# Altium project LEDeep_project.PrjPcb
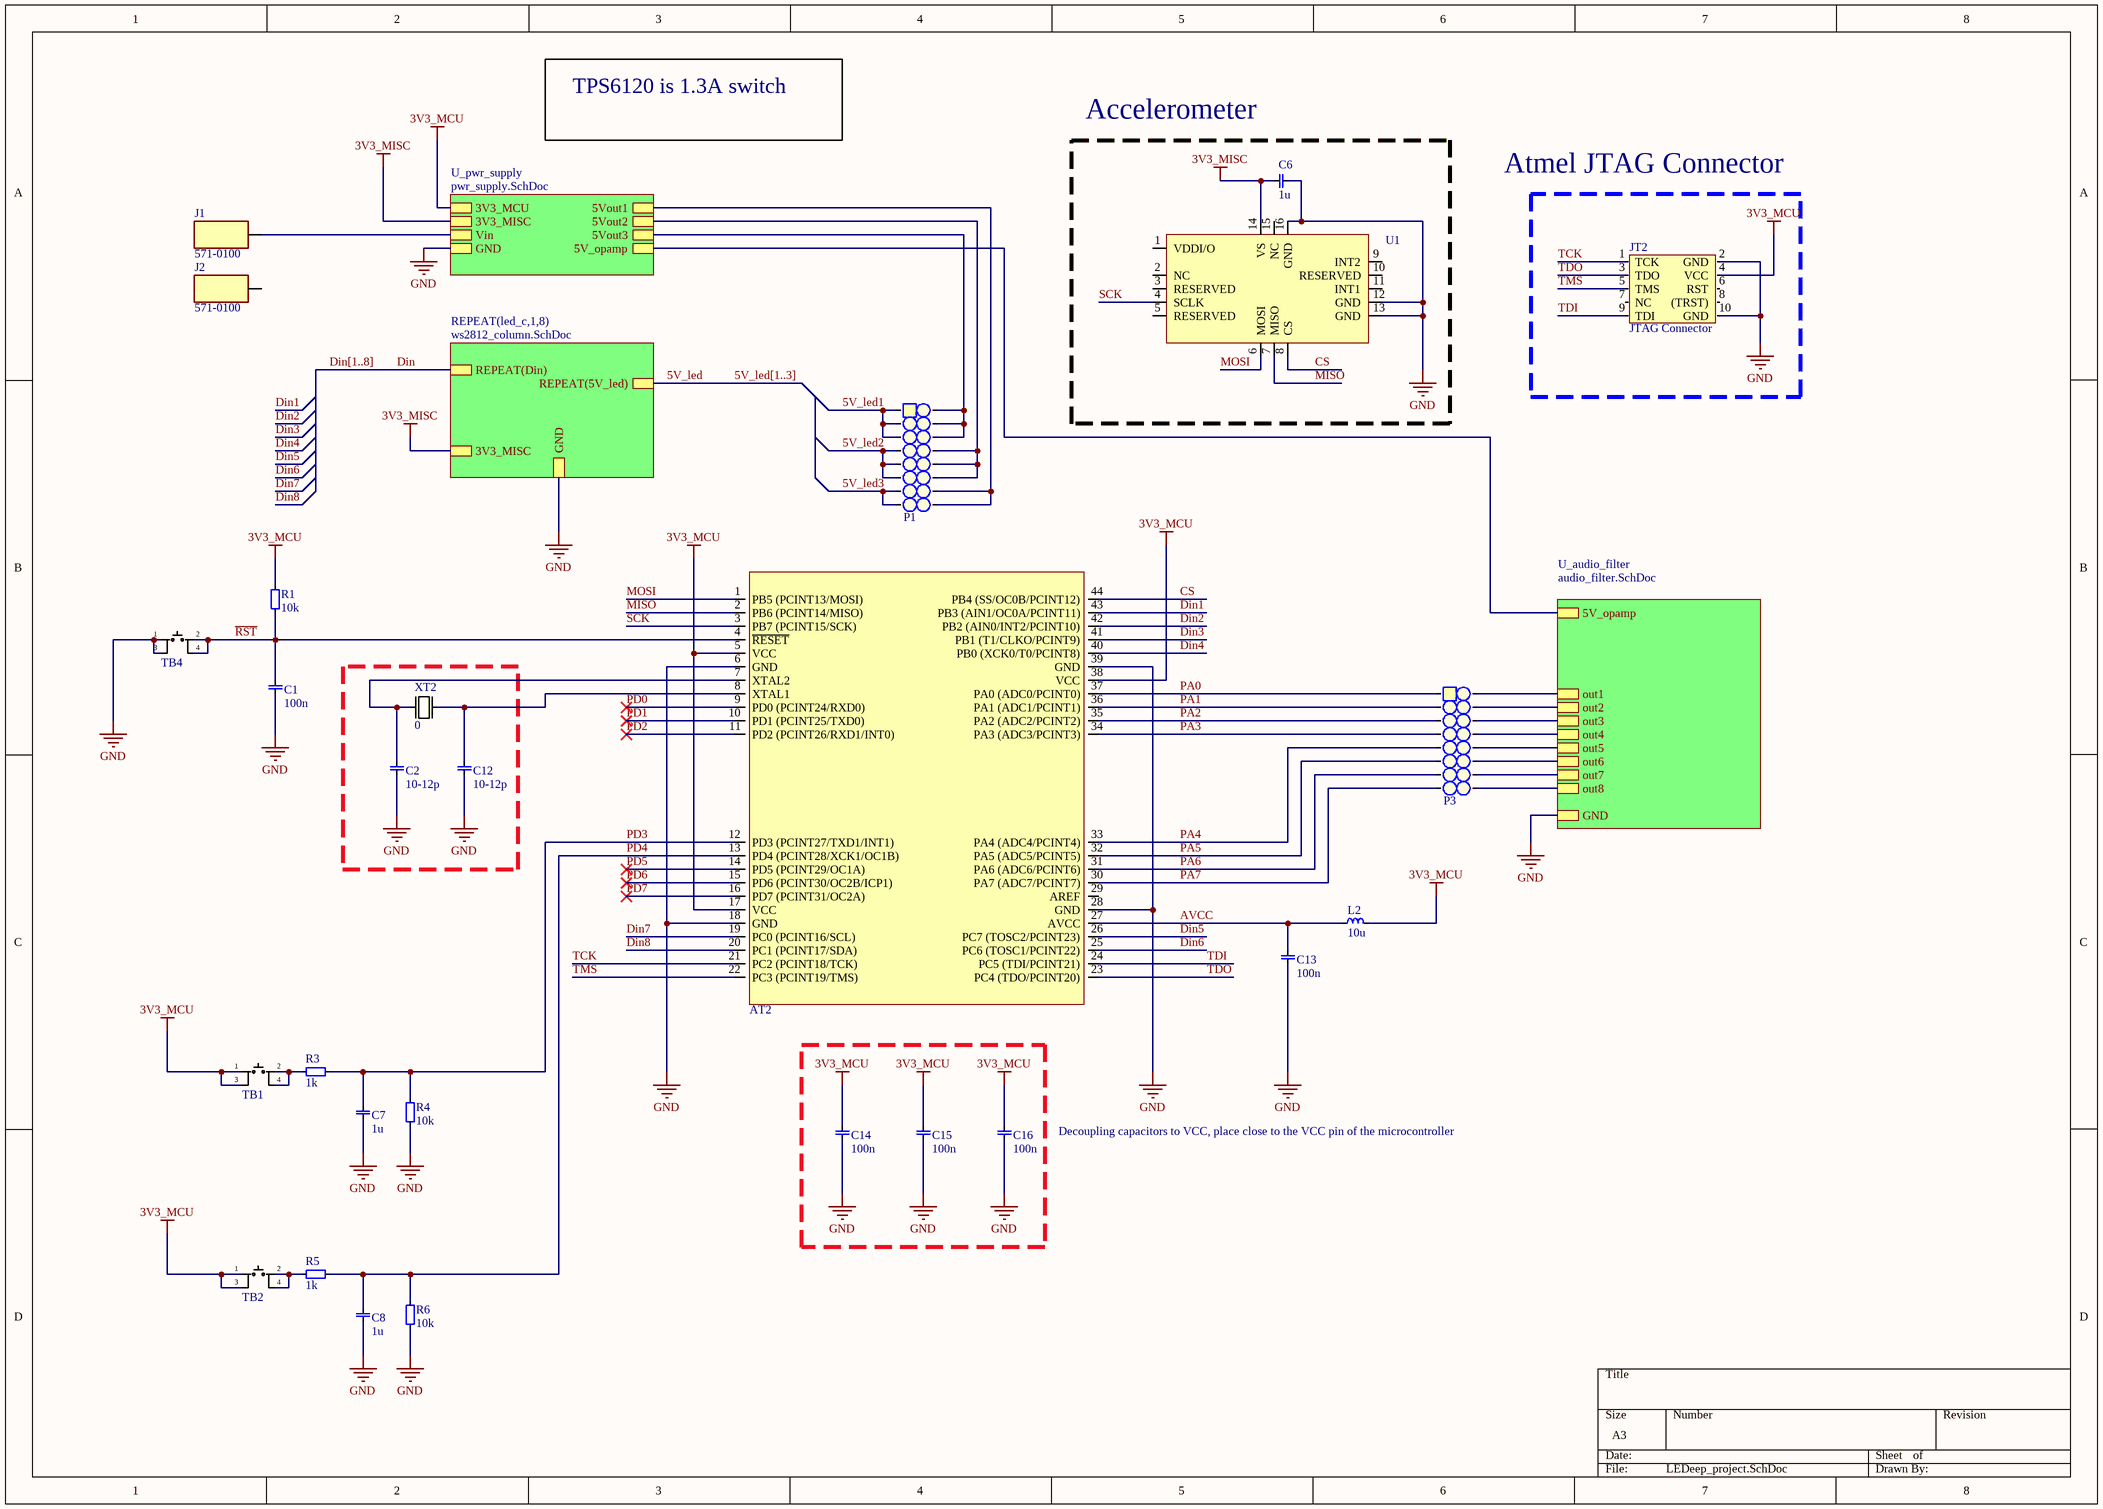
[diagram p0: LEDeep_project.SchDoc]
7 sheets, 404 parts. Net scope: strictly hierarchical (ports join the sheet entries above them; power ports are local).
Board file: led_project.PcbDoc
Sheets:
  LEDeep_project.SchDoc
    U_pwr_supply = pwr_supply.SchDoc
      LDO1 = tps79333.SchDoc
      LDO2 = tps79333.SchDoc
      5V_dcdc1 = tps61202.SchDoc
      5V_dcdc2 = tps61202.SchDoc
      5V_dcdc3 = tps61202.SchDoc
    led_c1 = ws2812_column.SchDoc
    led_c2 = ws2812_column.SchDoc
    led_c3 = ws2812_column.SchDoc
    led_c4 = ws2812_column.SchDoc
    led_c5 = ws2812_column.SchDoc
    led_c6 = ws2812_column.SchDoc
    led_c7 = ws2812_column.SchDoc
    led_c8 = ws2812_column.SchDoc
    U_audio_filter = audio_filter.schdoc
      BP_filter1 = bandpass_filter.schdoc
      BP_filter2 = bandpass_filter.schdoc
      BP_filter3 = bandpass_filter.schdoc
      BP_filter4 = bandpass_filter.schdoc
      BP_filter5 = bandpass_filter.schdoc
      BP_filter6 = bandpass_filter.schdoc
      BP_filter7 = bandpass_filter.schdoc
      BP_filter8 = bandpass_filter.schdoc

## Sheet LEDeep_project.SchDoc
size A3; SheetNumber: 1; SheetTotal: 7

### Parts
AT2  ATmega644PA  [TQFP-44]  (value not drawn)
C1  value 100n  [1206, capasitor]  (hidden comment: 1206, capacitor)
C2  value 10-12p  [1206, capasitor]  (hidden comment: 1206, capacitor)
C6  value 1u  [1206, capasitor]  (hidden comment: 1206, capacitor)
C7  value 1u  [1206, capasitor]  (hidden comment: 1206, capacitor)
C8  value 1u  [1206, capasitor]  (hidden comment: 1206, capacitor)
C12  value 10-12p  [1206, capasitor]  (hidden comment: 1206, capacitor)
C13  value 100n  [1206, capasitor]  (hidden comment: 1206, capacitor)
C14  value 100n  [1206, capasitor]  (hidden comment: 1206, capacitor)
C15  value 100n  [1206, capasitor]  (hidden comment: 1206, capacitor)
C16  value 100n  [1206, capasitor]  (hidden comment: 1206, capacitor)
J1  571-0100  [Banana Conn VCC]
J2  571-0100  [Banana Conn VCC]
JT2  JTAG Connector  [Atmel_JTAG]
L2  value 10u  [1812, coil]  (hidden comment: Coil)
P1  2x8 Pin Header  [2x8 Pin Header]  (value not drawn)
P3  2x8 Pin Header  [2x8 Pin Header]  (value not drawn)
R1  value 10k  [1206]  (hidden comment: 1206, resistor)
R3  value 1k  [1206]  (hidden comment: 1206, resistor)
R4  value 10k  [1206]  (hidden comment: 1206, resistor)
R5  value 1k  [1206]  (hidden comment: 1206, resistor)
R6  value 10k  [1206]  (hidden comment: 1206, resistor)
TB1  Tactile Button  [Button smd]  (value not drawn)
TB2  Tactile Button  [Button smd]  (value not drawn)
TB4  Tactile Button  [Button smd]  (value not drawn)
U1  ADXL344  [lag_16_5by3_3x3mm]  (value not drawn)
XT2  value 0  [XTAL_SMD_LP]  (hidden comment: XTAL TXC 7A)

### Blocks framed on the sheet
Accelerometer: C6 U1

### Sub-sheets
REPEAT(led_c,1,8) = ws2812_column.SchDoc: GND, REPEAT(5V_led), REPEAT(Din), 3V3_MISC
U_audio_filter = audio_filter.SchDoc: 5V_opamp, GND, out6, out2, out3, out5, out1, out4, out7, out8
U_pwr_supply = pwr_supply.SchDoc: Vin, GND, 5Vout1, 5Vout2, 5Vout3, 3V3_MISC, 3V3_MCU, 5V_opamp

### Nets
3V3_MCU: AT2.5(VCC) AT2.17(VCC) AT2.38(VCC) C14.1 C15.1 C16.1 JT2.4(VCC) L2.1 R1.0 TB1.1 TB1.3 TB2.1 TB2.3 ; sheet U_pwr_supply/3V3_MCU
3V3_MISC: C6.0 U1.14(VS) ; sheet U_pwr_supply/3V3_MISC, sheet REPEAT(led_c,1,8)/3V3_MISC
5V_opamp: sheet U_pwr_supply/5V_opamp, sheet U_audio_filter/5V_opamp
GND: AT2.6(GND) AT2.18(GND) AT2.28(GND) AT2.39(GND) C1.0 C2.0 C6.1 C7.0 C8.0 C12.0 C13.0 C14.0 C15.0 C16.0 JT2.2(GND) JT2.10(GND) R4.1 R6.1 TB4.1 TB4.3 U1.12(GND) U1.13(GND) U1.16(GND) ; sheet U_pwr_supply/GND, sheet REPEAT(led_c,1,8)/GND, sheet U_audio_filter/GND
5V_led: sheet REPEAT(led_c,1,8)/REPEAT(5V_led)
5V_led1: P1.1 P1.2 P1.3
5V_led2: P1.4 P1.5 P1.6
5V_led3: P1.7 P1.8
5Vout1: P1.9 P1.10 ; sheet U_pwr_supply/5Vout1
5Vout2: P1.11 P1.12 P1.13 ; sheet U_pwr_supply/5Vout2
5Vout3: P1.14 P1.15 P1.16 ; sheet U_pwr_supply/5Vout3
AVCC: AT2.27(AVCC) C13.1 L2.2
CS: AT2.44(PB4_(SS/OC0B/PCINT12)) U1.8(CS)
Din: sheet REPEAT(led_c,1,8)/REPEAT(Din)
Din1: AT2.43(PB3_(AIN1/OC0A/PCINT11))
Din2: AT2.42(PB2_(AIN0/INT2/PCINT10))
Din3: AT2.41(PB1_(T1/CLKO/PCINT9))
Din4: AT2.40(PB0_(XCK0/T0/PCINT8))
Din5: AT2.26(PC7_(TOSC2/PCINT23))
Din6: AT2.25(PC6_(TOSC1/PCINT22))
Din7: AT2.19(PC0_(PCINT16/SCL))
Din8: AT2.20(PC1_(PCINT17/SDA))
MISO: AT2.2(PB6_(PCINT14/MISO)) U1.7(MISO)
MOSI: AT2.1(PB5_(PCINT13/MOSI)) U1.6(MOSI)
out1: P3.16 ; sheet U_audio_filter/out1
out2: P3.15 ; sheet U_audio_filter/out2
out3: P3.14 ; sheet U_audio_filter/out3
out4: P3.13 ; sheet U_audio_filter/out4
out5: P3.12 ; sheet U_audio_filter/out5
out6: P3.11 ; sheet U_audio_filter/out6
out7: P3.10 ; sheet U_audio_filter/out7
out8: P3.9 ; sheet U_audio_filter/out8
PA0: AT2.37(PA0_(ADC0/PCINT0)) P3.1
PA1: AT2.36(PA1_(ADC1/PCINT1)) P3.2
PA2: AT2.35(PA2_(ADC2/PCINT2)) P3.3
PA3: AT2.34(PA3_(ADC3/PCINT3)) P3.4
PA4: AT2.33(PA4_(ADC4/PCINT4)) P3.5
PA5: AT2.32(PA5_(ADC5/PCINT5)) P3.6
PA6: AT2.31(PA6_(ADC6/PCINT6)) P3.7
PA7: AT2.30(PA7_(ADC7/PCINT7)) P3.8
PD0: AT2.9(PD0_(PCINT24/RXD0))
PD1: AT2.10(PD1_(PCINT25/TXD0))
PD2: AT2.11(PD2_(PCINT26/RXD1/INT0))
PD3: AT2.12(PD3_(PCINT27/TXD1/INT1)) C7.1 R3.0 R4.0
PD4: AT2.13(PD4_(PCINT28/XCK1/OC1B)) C8.1 R5.0 R6.0
PD5: AT2.14(PD5_(PCINT29/OC1A))
PD6: AT2.15(PD6_(PCINT30/OC2B/ICP1))
PD7: AT2.16(PD7_(PCINT31/OC2A))
~{RST}: AT2.4(~{RESET}) C1.1 R1.1 TB4.2 TB4.4
SCK: AT2.3(PB7_(PCINT15/SCK)) U1.4(SCLK)
TCK: AT2.21(PC2_(PCINT18/TCK)) JT2.1(TCK)
TDI: AT2.24(PC5_(TDI/PCINT21)) JT2.9(TDI)
TDO: AT2.23(PC4_(TDO/PCINT20)) JT2.3(TDO)
TMS: AT2.22(PC3_(PCINT19/TMS)) JT2.5(TMS)
NetAT2_7: AT2.7(XTAL2) C2.1 XT2.1
NetAT2_8: AT2.8(XTAL1) C12.1 XT2.2
NetC3_1: J1.1 ; sheet U_pwr_supply/Vin
NetR3_1: R3.1 TB1.2 TB1.4
NetR5_1: R5.1 TB2.2 TB2.4

Not connected (* = marked no-connect by the designer): AT2 29(AREF); J2 1; JT2 6(RST) 7(NC) 8((TRST)); U1 1(VDDI/O) 2(NC) 3(RESERVED) 5(RESERVED) 9(INT2) 10(RESERVED) 11(INT1) 15(NC)

### Buses and harness runs
bus 5V_led[1..3]
bus Din[1..8]

### Notes on the sheet
- TPS6120 is 1.3A switch
- Atmel JTAG Connector
- Decoupling capacitors to VCC, place close to the VCC pin of the microcontroller

### Library data of the parts
AT2 = ATmega644PA: ATmega644PA - Small but big and PicoPower; Farnell: 2484915; Value: ATmega644PA
J1 J2 = Banana conn: Banana Connector 571-0100; Manufacturer_Name: Deltron; Datasheet Link: https://www.dem-uk.com/deltron-components/Data/Product_Downloads/deltron-571-0100-4mm-90deg-single-socket-data.pdf; Height: 12.4mm; Manufacturer_Part_Number: 571-0100; Mouser Part Number: 164-6218; Mouser Price/Stock: https://www.mouser.com/Search/Refine.aspx?Keyword=164-6218
JT2 = Atmel JTAG: Atmel JTAG Connector
P1 P3 = 2x8 Pin Header: 2.54 mm; Value: 1x8 Pin Header
R1 R3-R6 = 1206, resistor: Resistor
  R1 R4 R6: DigiKey: RMCF1206JT10K0CT-ND
  R3 R5: DigiKey: RPC1206JT1K00CT-ND
TB1 TB2 TB4 = Button SMD: Tactile Switch Small Low; ELFA: 110-87-406; Value: Button SMD
U1 = ADXL344: 3-Axis, ±2 g/±4 g/±8 g/±16 g Ultralow / Power Digital MEMS Accelerometer; DigiKey: ADXL344ACCZ-RL7
XT2 = XTAL TXC 7A: 16 MHz, SMD, 5mm x 3,2mm, 30 ppm; Farnell: 1841946
C1 C2 C6-C8 C12-C16 = 1206, capacitor
  C1 C13-C16: DigiKey: 399-C1206C104M5RACAUTOCT-ND
  C2 C12: DigiKey: 399-C1206C100J5GAC7800CT-ND
  C6-C8: DigiKey: 1276-3298-1-ND

## Sheet pwr_supply.SchDoc
size A4; SheetNumber: 2; SheetTotal: 7
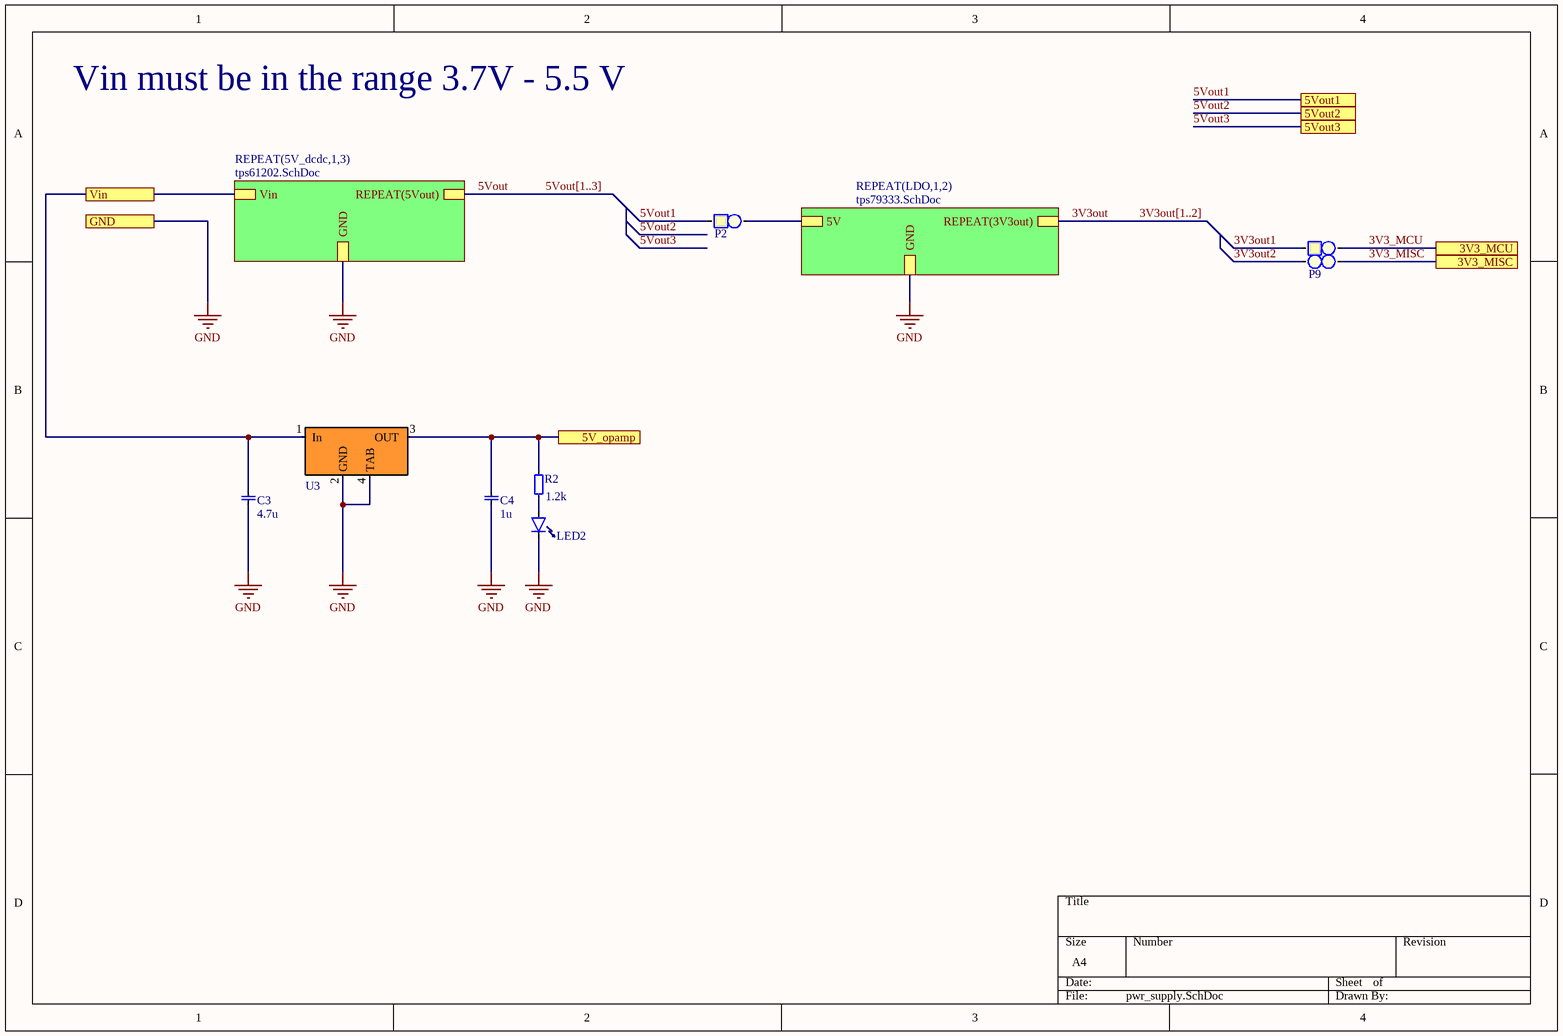
[diagram p1: pwr_supply.SchDoc]

### Parts
C3  value 4.7u  [1206, capasitor]  (hidden comment: 1206, capacitor)
C4  value 1u  [1206, capasitor]  (hidden comment: 1206, capacitor)
LED2  0805, LED  [0805_led]  (value not drawn)
P2  Jumper  [padtwo_L]  (value not drawn)
P9  2x2 Pin Header  [2x2 PH]  (value not drawn)
R2  value 1.2k  [1206]  (hidden comment: 1206, resistor)
U3  MCP1826S  [SOT223]  (value not drawn)

### Sub-sheets
REPEAT(5V_dcdc,1,3) = tps61202.SchDoc: Vin, REPEAT(5Vout), GND
REPEAT(LDO,1,2) = tps79333.SchDoc: REPEAT(3V3out), GND, 5V

### Ports
3V3_MCU, 3V3_MISC, 5V_opamp, 5Vout1, 5Vout2, 5Vout3, GND, Vin

### Nets
3V3_MCU: P9.4 ; port 3V3_MCU
3V3_MISC: P9.3 ; port 3V3_MISC
5V_opamp: C4.1 R2.0 U3.3(OUT) ; port 5V_opamp
GND: C3.0 C4.0 LED2.0(Cathode) U3.2(GND) U3.4(TAB) ; port GND, sheet REPEAT(LDO,1,2)/GND, sheet REPEAT(5V_dcdc,1,3)/GND
3V3out: sheet REPEAT(LDO,1,2)/REPEAT(3V3out)
3V3out1: P9.1
3V3out2: P9.2
5Vout: sheet REPEAT(5V_dcdc,1,3)/REPEAT(5Vout)
5Vout1: P2.1 ; port 5Vout1
NetC3_1: C3.1 U3.1(In) ; port Vin, sheet REPEAT(5V_dcdc,1,3)/Vin
NetLED2_1: LED2.1 R2.1
NetP2_2: P2.2 ; sheet REPEAT(LDO,1,2)/5V

### Buses and harness runs
bus 3V3out[1..2]
bus 5Vout[1..3]

### Notes on the sheet
- Vin must be in the range 3.7V - 5.5 V

### Library data of the parts
LED2 = 0805, LED: Value: 0805 LED
P2 = Jumper: 2.54 mm, TH; Value: 1x2 Pin Header
P9 = 2x2 Pin Header: Value: 2x2 Pin Header, 2.54mm
R2 = 1206, resistor: Resistor; DigiKey: RMCF1206JT1K20TR-ND
U3 = MCP1826S: Max input voltage is 6.0 V, tab connects to ground; DigiKey: MCP1826S-5002E/DB-ND
C3 C4 = 1206, capacitor
  C4: DigiKey: 478-12816-1-ND

## Sheet tps79333.SchDoc
size A4; SheetNumber: 4; SheetTotal: 7
Used 2 times, as channels U_pwr_supply/LDO1, U_pwr_supply/LDO2. Parts and nets are listed once, with the designators drawn on the sheet.
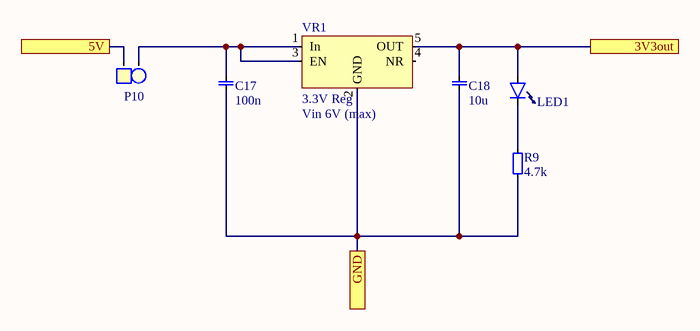
[diagram p2: tps79333.SchDoc]

### Parts
C17  value 100n  [1206, capasitor]  (hidden comment: 1206, capacitor)
C18  value 10u  [1206, capasitor]  (hidden comment: 1206, capacitor)
LED1  0805, LED  [0805_led]  (value not drawn)
P10  1x2 Pin Header  [1x2HEADER]  (value not drawn)
R9  value 4.7k  [1206]  (hidden comment: 1206, resistor)
VR1  3.3V Reg  Input Voltage: Vin 6V (max)  [SOT23-5]

### Ports
3V3out, 5V, GND

### Nets
3V3out: C18.1 LED1.1 VR1.5(OUT) ; port 3V3out
5V: P10.1 ; port 5V
GND: C17.0 C18.0 R9.1 VR1.2(GND) ; port GND
NetC17_1: C17.1 P10.2 VR1.1(In) VR1.3(EN)
NetLED1_0: LED1.0(Cathode) R9.0

Not connected (* = marked no-connect by the designer): VR1 4(NR)

### Channels
U_pwr_supply/LDO1: designators end in _LDO1; ports 3V3out=3V3out1 5V=NetP2_2 GND=GND
U_pwr_supply/LDO2: designators end in _LDO2; ports 3V3out=3V3out2 5V=NetP2_2 GND=GND

### Library data of the parts
LED1 = 0805, LED: Value: 0805 LED
P10 = 1x2 Pin Header: 2.54 mm, TH; Value: 1x2 Pin Header
R9 = 1206, resistor: Resistor; DigiKey: RMCF1206JT4K70CT-ND
VR1 = TPS79333DBR: 3.3V Reg, Ultra-Low Noise, 200 mA; Value: TPS79333DBVR; Drop Out: 102mV; Farnell: 1287689
C17 C18 = 1206, capacitor
  C17: DigiKey: 399-C1206C104M5RACAUTOCT-ND
  C18: DigiKey: 1276-3298-1-ND

## Sheet tps61202.SchDoc
size A4; SheetNumber: 3; SheetTotal: 7
Used 3 times, as channels U_pwr_supply/5V_dcdc1, U_pwr_supply/5V_dcdc2, U_pwr_supply/5V_dcdc3. Parts and nets are listed once, with the designators drawn on the sheet.
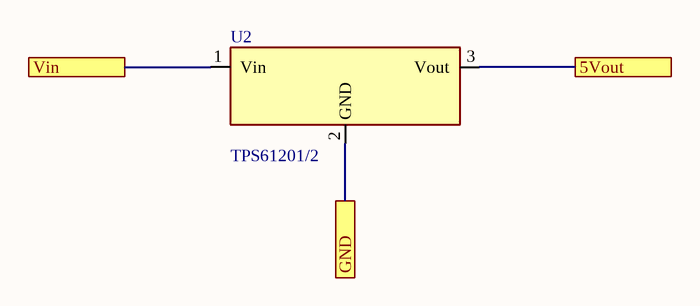
[diagram p3: tps61202.SchDoc]

### Parts
U2  TPS61201/2  [tps61201_2]

### Ports
5Vout, GND, Vin

### Nets
5Vout: U2.3(Vout) ; port 5Vout
GND: U2.2(GND) ; port GND
Vin: U2.1(Vin) ; port Vin

### Channels
U_pwr_supply/5V_dcdc1: designators end in _5V_dcdc1; ports 5Vout=5Vout1 GND=GND Vin=NetC3_1
U_pwr_supply/5V_dcdc2: designators end in _5V_dcdc2; ports 5Vout=5Vout2 GND=GND Vin=NetC3_1
U_pwr_supply/5V_dcdc3: designators end in _5V_dcdc3; ports 5Vout=5Vout3 GND=GND Vin=NetC3_1

### Library data of the parts
U2 = TPS61201/2: DigiKey: TPS61202DRCR

## Sheet ws2812_column.SchDoc
size A4; SheetNumber: 5; SheetTotal: 7
Used 8 times, as channels led_c1, led_c2, led_c3, led_c4, led_c5, led_c6, led_c7, led_c8. Parts and nets are listed once, with the designators drawn on the sheet.
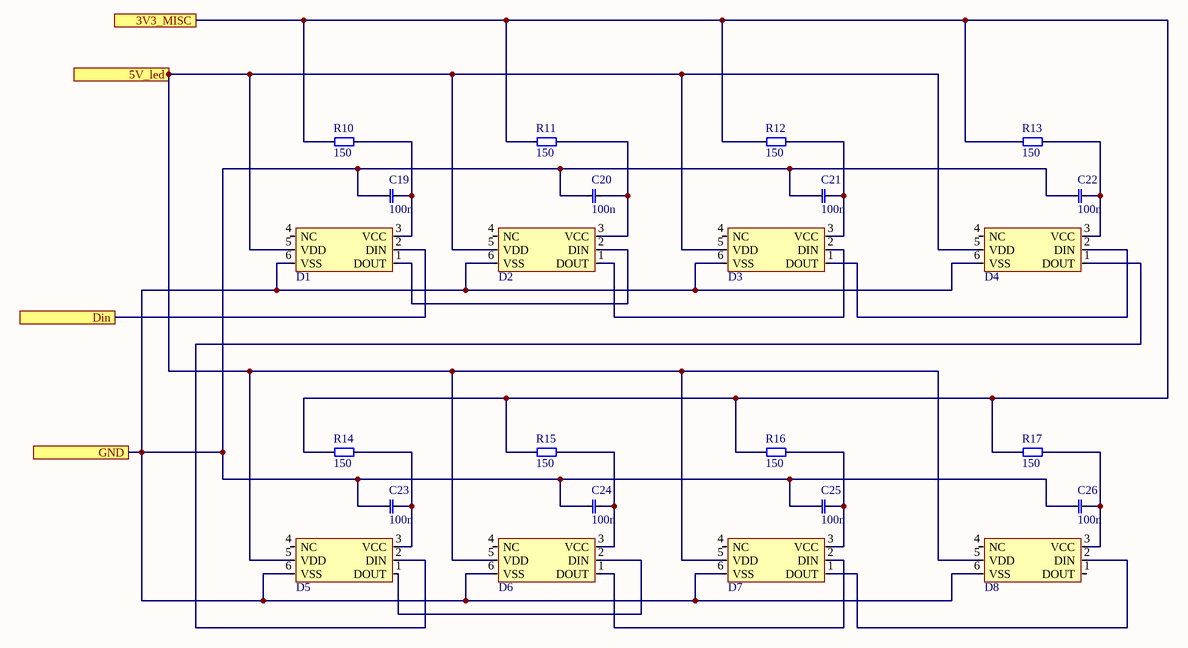
[diagram p4: ws2812_column.SchDoc]

### Parts
C19  value 100n  [1206, capasitor]  (hidden comment: 1206, capacitor)
C20  value 100n  [1206, capasitor]  (hidden comment: 1206, capacitor)
C21  value 100n  [1206, capasitor]  (hidden comment: 1206, capacitor)
C22  value 100n  [1206, capasitor]  (hidden comment: 1206, capacitor)
C23  value 100n  [1206, capasitor]  (hidden comment: 1206, capacitor)
C24  value 100n  [1206, capasitor]  (hidden comment: 1206, capacitor)
C25  value 100n  [1206, capasitor]  (hidden comment: 1206, capacitor)
C26  value 100n  [1206, capasitor]  (hidden comment: 1206, capacitor)
D1  Neo - WS2812  [NEOPIXEL]  (value not drawn)
D2  Neo - WS2812  [NEOPIXEL]  (value not drawn)
D3  Neo - WS2812  [NEOPIXEL]  (value not drawn)
D4  Neo - WS2812  [NEOPIXEL]  (value not drawn)
D5  Neo - WS2812  [NEOPIXEL]  (value not drawn)
D6  Neo - WS2812  [NEOPIXEL]  (value not drawn)
D7  Neo - WS2812  [NEOPIXEL]  (value not drawn)
D8  Neo - WS2812  [NEOPIXEL]  (value not drawn)
R10  value 150  [1206]  (hidden comment: 1206, resistor)
R11  value 150  [1206]  (hidden comment: 1206, resistor)
R12  value 150  [1206]  (hidden comment: 1206, resistor)
R13  value 150  [1206]  (hidden comment: 1206, resistor)
R14  value 150  [1206]  (hidden comment: 1206, resistor)
R15  value 150  [1206]  (hidden comment: 1206, resistor)
R16  value 150  [1206]  (hidden comment: 1206, resistor)
R17  value 150  [1206]  (hidden comment: 1206, resistor)

### Ports
3V3_MISC, 5V_led, Din, GND

### Nets
3V3_MISC: R10.1 R11.1 R12.1 R13.1 R14.1 R15.1 R16.1 R17.1 ; port 3V3_MISC
5V_led: D1.5(VDD) D2.5(VDD) D3.5(VDD) D4.5(VDD) D5.5(VDD) D6.5(VDD) D7.5(VDD) D8.5(VDD) ; port 5V_led
Din: D1.2(DIN) ; port Din
GND: C19.0 C20.0 C21.0 C22.0 C23.0 C24.0 C25.0 C26.0 D1.6(VSS) D2.6(VSS) D3.6(VSS) D4.6(VSS) D5.6(VSS) D6.6(VSS) D7.6(VSS) D8.6(VSS) ; port GND
NetC19_1: C19.1 D1.3(VCC) R10.0
NetC20_1: C20.1 D2.3(VCC) R11.0
NetC21_1: C21.1 D3.3(VCC) R12.0
NetC22_1: C22.1 D4.3(VCC) R13.0
NetC23_1: C23.1 D5.3(VCC) R14.0
NetC24_1: C24.1 D6.3(VCC) R15.0
NetC25_1: C25.1 D7.3(VCC) R16.0
NetC26_1: C26.1 D8.3(VCC) R17.0
NetD1_1: D1.1(DOUT) D2.2(DIN)
NetD2_1: D2.1(DOUT) D3.2(DIN)
NetD3_1: D3.1(DOUT) D4.2(DIN)
NetD4_1: D4.1(DOUT) D5.2(DIN)
NetD5_1: D5.1(DOUT) D6.2(DIN)
NetD6_1: D6.1(DOUT) D7.2(DIN)
NetD7_1: D7.1(DOUT) D8.2(DIN)

Not connected (* = marked no-connect by the designer): D1 4(NC); D2 4(NC); D3 4(NC); D4 4(NC); D5 4(NC); D6 4(NC); D7 4(NC); D8 1(DOUT) 4(NC)

### Channels
led_c1: designators end in _led_column1; ports 3V3_MISC=3V3_MISC 5V_led=5V_led1 Din=Din1 GND=GND
led_c2: designators end in _led_column2; ports 3V3_MISC=3V3_MISC 5V_led=5V_led2 Din=Din2 GND=GND
led_c3: designators end in _led_column3; ports 3V3_MISC=3V3_MISC 5V_led=5V_led3 Din=Din3 GND=GND
led_c4: designators end in _led_column4; ports 3V3_MISC=3V3_MISC 5V_led=5V_led4 Din=Din4 GND=GND
led_c5: designators end in _led_column5; ports 3V3_MISC=3V3_MISC 5V_led=5V_led5 Din=Din5 GND=GND
led_c6: designators end in _led_column6; ports 3V3_MISC=3V3_MISC 5V_led=5V_led6 Din=Din6 GND=GND
led_c7: designators end in _led_column7; ports 3V3_MISC=3V3_MISC 5V_led=5V_led7 Din=Din7 GND=GND
led_c8: designators end in _led_column8; ports 3V3_MISC=3V3_MISC 5V_led=5V_led8 Din=Din8 GND=GND

### Library data of the parts
R10-R17 = 1206, resistor: Resistor; DigiKey: RMCF1206JT150RCT-ND
C19-C26 = 1206, capacitor: DigiKey: 399-C1206C104M5RACAUTOCT-ND
D1-D8 = Neo - WS2812: Value: WS2812; DigiKey: 1568-1800-ND

## Sheet audio_filter.schdoc
size A3; SheetNumber: 6; SheetTotal: 7
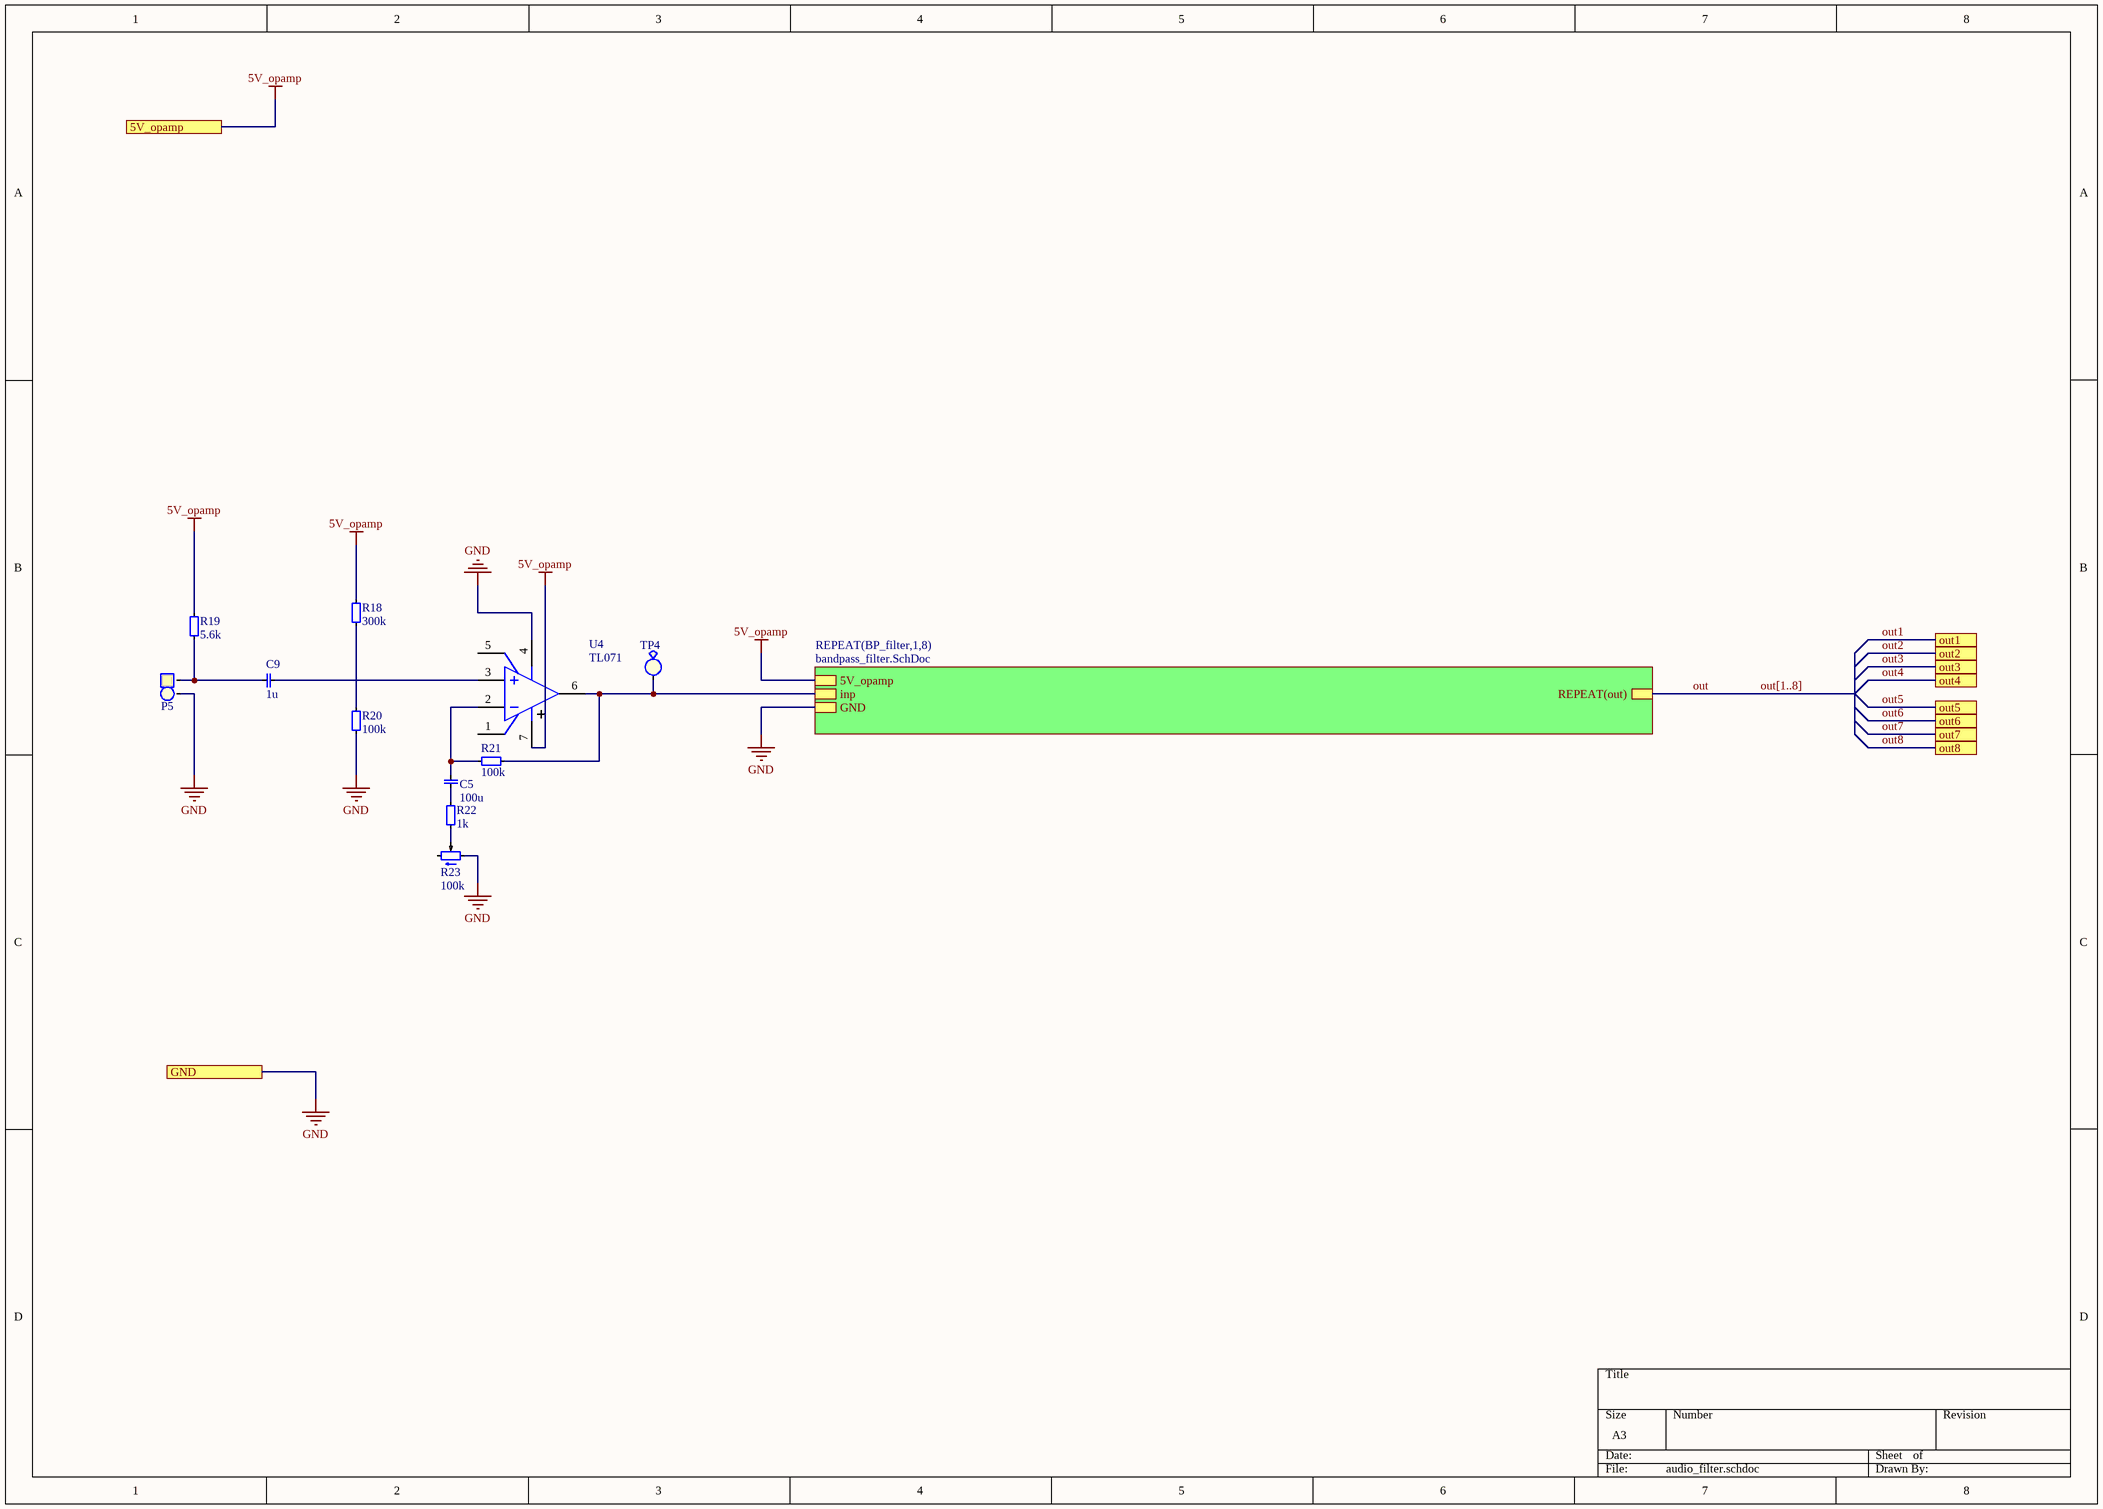
[diagram p5: audio_filter.schdoc]

### Parts
C5  value 100u  [1206, capasitor]  (hidden comment: 1206, capacitor)
C9  value 1u  [1206, capasitor]  (hidden comment: 1206, capacitor)
P5  1x2 Pin Header  [padtwo_L]  (value not drawn)
R18  value 300k  [1206]  (hidden comment: 1206, resistor)
R19  value 5.6k  [1206]  (hidden comment: 1206, resistor)
R20  value 100k  [1206]  (hidden comment: 1206, resistor)
R21  value 100k  [1206]  (hidden comment: 1206, resistor)
R22  value 1k  [1206]  (hidden comment: 1206, resistor)
R23  value 100k  [POT_TH1]  (hidden comment: Pot)
TP4  Test Point  [testPoint]  (value not drawn)
U4  TL071  [SOIC8]

### Sub-sheets
REPEAT(BP_filter,1,8) = bandpass_filter.SchDoc: 5V_opamp, inp, GND, REPEAT(out)

### Ports
5V_opamp, GND, out1, out2, out3, out4, out5, out6, out7, out8

### Nets
5V_opamp: R18.0 R19.0 U4.7(V+) ; port 5V_opamp, sheet REPEAT(BP_filter,1,8)/5V_opamp
GND: P5.2 R20.1 R23.1 U4.4(V-) ; port GND, sheet REPEAT(BP_filter,1,8)/GND
out: sheet REPEAT(BP_filter,1,8)/REPEAT(out)
NetC5_0: C5.0 R21.0 U4.2(IN-)
NetC5_1: C5.1 R22.0
NetC9_0: C9.0 U4.3(IN+)
NetC9_1: C9.1 P5.1 R19.1
NetR18_1: R18.1 R20.0
NetR21_1: R21.1 TP4.0 U4.6(OUT) ; sheet REPEAT(BP_filter,1,8)/inp
NetR22_1: R22.1 R23.2

Not connected (* = marked no-connect by the designer): R23 3; U4 1(OS_TRIM) 5(OS_TRIM)

### Buses and harness runs
bus out[1..8]

### Library data of the parts
P5 = 1x2 Pin Header: 2.54 mm, TH; Value: 1x2 Pin Header
R18-R22 = 1206, resistor: Resistor
  R18: DigiKey: RMCF1206FT300KCT-ND
  R19: DigiKey: RMCF1206JT5K60CT-ND
  R20 R21: DigiKey: RMCF1206JT100KCT-ND
  R22: DigiKey: RPC1206JT1K00CT-ND
C5 C9 = 1206, capacitor
  C5: DigiKey: 13-CC1206MKX5R5BB107CT-ND
  C9: DigiKey: 478-12816-1-ND
R23 = Pot: DigiKey: 3362R-1-104LF
TP4 = Test Point: Value: Test point; Farnell: 1702006
U4 = TL071: Digikey: 296-15001-1-ND

## Sheet bandpass_filter.schdoc
size A3; SheetNumber: 7; SheetTotal: 7
Used 8 times, as channels U_audio_filter/BP_filter1, U_audio_filter/BP_filter2, U_audio_filter/BP_filter3, U_audio_filter/BP_filter4, U_audio_filter/BP_filter5, U_audio_filter/BP_filter6, U_audio_filter/BP_filter7, U_audio_filter/BP_filter8. Parts and nets are listed once, with the designators drawn on the sheet.
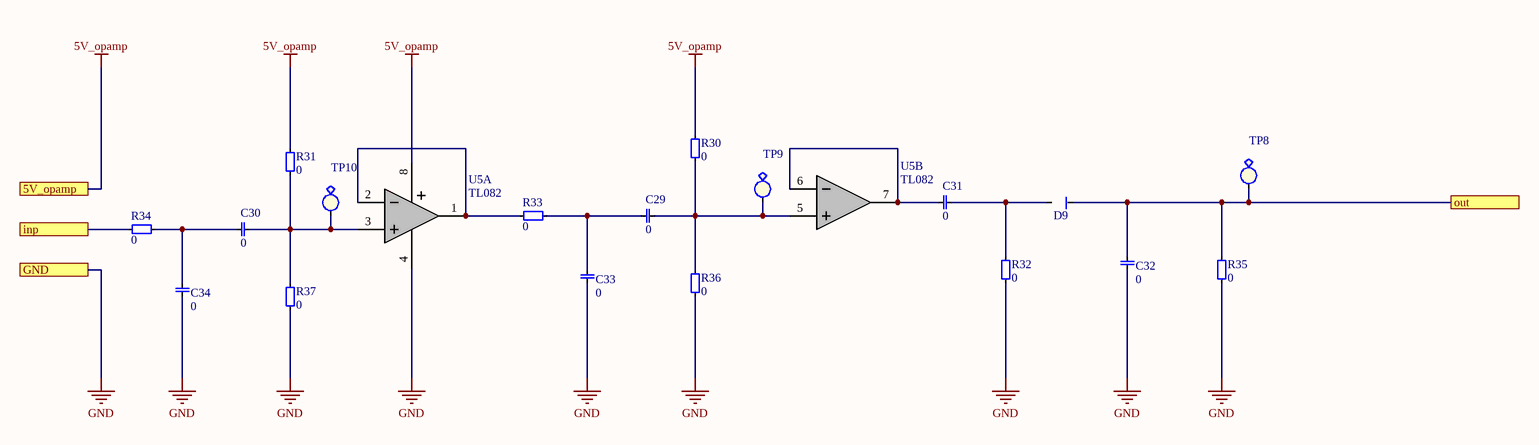
[diagram p6: bandpass_filter.schdoc]

### Parts
C29  value 0  [1206, capasitor]  (hidden comment: 1206, capacitor)
C30  value 0  [1206, capasitor]  (hidden comment: 1206, capacitor)
C31  value 0  [1206, capasitor]  (hidden comment: 1206, capacitor)
C32  value 0  [1206, capasitor]  (hidden comment: 1206, capacitor)
C33  value 0  [1206, capasitor]  (hidden comment: 1206, capacitor)
C34  value 0  [1206, capasitor]  (hidden comment: 1206, capacitor)
D9  Diode, TH  [TO-220-F2]  (value not drawn)
R30  value 0  [1206]  (hidden comment: 1206, resistor)
R31  value 0  [1206]  (hidden comment: 1206, resistor)
R32  value 0  [1206]  (hidden comment: 1206, resistor)
R33  value 0  [1206]  (hidden comment: 1206, resistor)
R34  value 0  [1206]  (hidden comment: 1206, resistor)
R35  value 0  [1206]  (hidden comment: 1206, resistor)
R36  value 0  [1206]  (hidden comment: 1206, resistor)
R37  value 0  [1206]  (hidden comment: 1206, resistor)
TP8  Test Point  [testPoint]  (value not drawn)
TP9  Test Point  [testPoint]  (value not drawn)
TP10  Test Point  [testPoint]  (value not drawn)
U5  TL082  [SOIC8]  (parts A,B of 2)

### Ports
5V_opamp, GND, inp, out

### Nets
5V_opamp: R30.0 R31.0 U5.8(V+) ; port 5V_opamp
GND: C32.0 C33.0 C34.0 R32.1 R35.1 R36.1 R37.1 U5.4(V-) ; port GND
inp: R34.1 ; port inp
out: C32.1 D9.1 R35.0 TP8.0 ; port out
NetC29_0: C29.0 R30.1 R36.0 TP9.0 U5.5(IN+)
NetC29_1: C29.1 C33.1 R33.0
NetC30_0: C30.0 R31.1 R37.0 TP10.0 U5.3(IN+)
NetC30_1: C30.1 C34.1 R34.0
NetC31_0: C31.0 D9.2 R32.0
NetC31_1: C31.1 U5.6(IN-) U5.7(OUT2)
NetR33_1: R33.1 U5.1(OUT1) U5.2(IN-)

### Channels
U_audio_filter/BP_filter1: designators end in A; ports 5V_opamp=5V_opamp GND=GND inp=NetR21_1 out=out1
U_audio_filter/BP_filter2: designators end in B; ports 5V_opamp=5V_opamp GND=GND inp=NetR21_1 out=out2
U_audio_filter/BP_filter3: designators end in C; ports 5V_opamp=5V_opamp GND=GND inp=NetR21_1 out=out3
U_audio_filter/BP_filter4: designators end in D; ports 5V_opamp=5V_opamp GND=GND inp=NetR21_1 out=out4
U_audio_filter/BP_filter5: designators end in E; ports 5V_opamp=5V_opamp GND=GND inp=NetR21_1 out=out5
U_audio_filter/BP_filter6: designators end in F; ports 5V_opamp=5V_opamp GND=GND inp=NetR21_1 out=out6
U_audio_filter/BP_filter7: designators end in G; ports 5V_opamp=5V_opamp GND=GND inp=NetR21_1 out=out7
U_audio_filter/BP_filter8: designators end in H; ports 5V_opamp=5V_opamp GND=GND inp=NetR21_1 out=out8

### Library data of the parts
R30-R37 = 1206, resistor: Resistor
U5 = TL082: Dual FET-Input Operational Amplifier; Digikey: TL082CM/NOPB-ND
TP8-TP10 = Test Point: Value: Test point; Farnell: 1702006

## Nets that join several sheets
3V3_MCU: LEDeep_project (13 pins), pwr_supply (P9.4)
3V3_MISC: LEDeep_project (C6.0 U1.14), pwr_supply (P9.3), led_c1 (8 pins), led_c2 (8 pins), led_c3 (8 pins), led_c4 (8 pins), led_c5 (8 pins), led_c6 (8 pins), led_c7 (8 pins), led_c8 (8 pins)
5V_opamp: pwr_supply (C4.1 R2.0 U3.3), audio_filter (R18.0 R19.0 U4.7), U_audio_filter/BP_filter1 (R30A.0 R31A.0 U5A.8), U_audio_filter/BP_filter2 (R30B.0 R31B.0 U5B.8), U_audio_filter/BP_filter3 (R30C.0 R31C.0 U5C.8), U_audio_filter/BP_filter4 (R30D.0 R31D.0 U5D.8), U_audio_filter/BP_filter5 (R30E.0 R31E.0 U5E.8), U_audio_filter/BP_filter6 (R30F.0 R31F.0 U5F.8), U_audio_filter/BP_filter7 (R30G.0 R31G.0 U5G.8), U_audio_filter/BP_filter8 (R30H.0 R31H.0 U5H.8)
GND: LEDeep_project (23 pins), pwr_supply (5 pins), U_pwr_supply/LDO1 (C17_LDO1.0 C18_LDO1.0 R9_LDO1.1 VR1_LDO1.2), U_pwr_supply/LDO2 (C17_LDO2.0 C18_LDO2.0 R9_LDO2.1 VR1_LDO2.2), U_pwr_supply/5V_dcdc1 (U2_5V_dcdc1.2), U_pwr_supply/5V_dcdc2 (U2_5V_dcdc2.2), U_pwr_supply/5V_dcdc3 (U2_5V_dcdc3.2), led_c1 (16 pins), led_c2 (16 pins), led_c3 (16 pins), led_c4 (16 pins), led_c5 (16 pins), led_c6 (16 pins), led_c7 (16 pins), led_c8 (16 pins), audio_filter (P5.2 R20.1 R23.1 U4.4), U_audio_filter/BP_filter1 (8 pins), U_audio_filter/BP_filter2 (8 pins), U_audio_filter/BP_filter3 (8 pins), U_audio_filter/BP_filter4 (8 pins), U_audio_filter/BP_filter5 (8 pins), U_audio_filter/BP_filter6 (8 pins), U_audio_filter/BP_filter7 (8 pins), U_audio_filter/BP_filter8 (8 pins)
3V3out1: pwr_supply (P9.1), U_pwr_supply/LDO1 (C18_LDO1.1 LED1_LDO1.1 VR1_LDO1.5)
3V3out2: pwr_supply (P9.2), U_pwr_supply/LDO2 (C18_LDO2.1 LED1_LDO2.1 VR1_LDO2.5)
5V_led1: LEDeep_project (P1.1 P1.2 P1.3), led_c1 (8 pins)
5V_led2: LEDeep_project (P1.4 P1.5 P1.6), led_c2 (8 pins)
5V_led3: LEDeep_project (P1.7 P1.8), led_c3 (8 pins)
5Vout1: LEDeep_project (P1.9 P1.10), pwr_supply (P2.1), U_pwr_supply/5V_dcdc1 (U2_5V_dcdc1.3)
5Vout2: LEDeep_project (P1.11 P1.12 P1.13), U_pwr_supply/5V_dcdc2 (U2_5V_dcdc2.3)
5Vout3: LEDeep_project (P1.14 P1.15 P1.16), U_pwr_supply/5V_dcdc3 (U2_5V_dcdc3.3)
Din1: LEDeep_project (AT2.43), led_c1 (D1_led_column1.2)
Din2: LEDeep_project (AT2.42), led_c2 (D1_led_column2.2)
Din3: LEDeep_project (AT2.41), led_c3 (D1_led_column3.2)
Din4: LEDeep_project (AT2.40), led_c4 (D1_led_column4.2)
Din5: LEDeep_project (AT2.26), led_c5 (D1_led_column5.2)
Din6: LEDeep_project (AT2.25), led_c6 (D1_led_column6.2)
Din7: LEDeep_project (AT2.19), led_c7 (D1_led_column7.2)
Din8: LEDeep_project (AT2.20), led_c8 (D1_led_column8.2)
NetC3_1: LEDeep_project (J1.1), pwr_supply (C3.1 U3.1), U_pwr_supply/5V_dcdc1 (U2_5V_dcdc1.1), U_pwr_supply/5V_dcdc2 (U2_5V_dcdc2.1), U_pwr_supply/5V_dcdc3 (U2_5V_dcdc3.1)
NetP2_2: pwr_supply (P2.2), U_pwr_supply/LDO1 (P10_LDO1.1), U_pwr_supply/LDO2 (P10_LDO2.1)
NetR21_1: audio_filter (R21.1 TP4.0 U4.6), U_audio_filter/BP_filter1 (R34A.1), U_audio_filter/BP_filter2 (R34B.1), U_audio_filter/BP_filter3 (R34C.1), U_audio_filter/BP_filter4 (R34D.1), U_audio_filter/BP_filter5 (R34E.1), U_audio_filter/BP_filter6 (R34F.1), U_audio_filter/BP_filter7 (R34G.1), U_audio_filter/BP_filter8 (R34H.1)
out1: LEDeep_project (P3.16), U_audio_filter/BP_filter1 (C32A.1 D9A.1 R35A.0 TP8A.0)
out2: LEDeep_project (P3.15), U_audio_filter/BP_filter2 (C32B.1 D9B.1 R35B.0 TP8B.0)
out3: LEDeep_project (P3.14), U_audio_filter/BP_filter3 (C32C.1 D9C.1 R35C.0 TP8C.0)
out4: LEDeep_project (P3.13), U_audio_filter/BP_filter4 (C32D.1 D9D.1 R35D.0 TP8D.0)
out5: LEDeep_project (P3.12), U_audio_filter/BP_filter5 (C32E.1 D9E.1 R35E.0 TP8E.0)
out6: LEDeep_project (P3.11), U_audio_filter/BP_filter6 (C32F.1 D9F.1 R35F.0 TP8F.0)
out7: LEDeep_project (P3.10), U_audio_filter/BP_filter7 (C32G.1 D9G.1 R35G.0 TP8G.0)
out8: LEDeep_project (P3.9), U_audio_filter/BP_filter8 (C32H.1 D9H.1 R35H.0 TP8H.0)